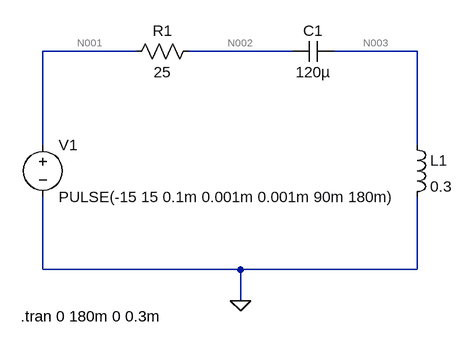
[diagram p0: schematic schemeRLC.asc]
schemeRLC.asc, the LTspice schematic file:
Version 4
SHEET 1 880 680
WIRE 96 96 -48 96
WIRE 336 96 176 96
WIRE 528 96 400 96
WIRE -48 240 -48 96
WIRE 528 240 528 96
WIRE -48 432 -48 320
WIRE 256 432 -48 432
WIRE 528 432 528 320
WIRE 528 432 256 432
WIRE 256 480 256 432
FLAG 256 480 0
SYMBOL res 192 80 R90
WINDOW 0 0 56 VBottom 2
WINDOW 3 32 56 VTop 2
SYMATTR InstName R1
SYMATTR Value 25
SYMBOL cap 400 80 R90
WINDOW 0 0 32 VBottom 2
WINDOW 3 32 32 VTop 2
SYMATTR InstName C1
SYMATTR Value 120µ
SYMBOL ind 512 224 R0
SYMATTR InstName L1
SYMATTR Value 0.3
SYMBOL voltage -48 224 R0
WINDOW 123 0 0 Left 0
WINDOW 39 0 0 Left 0
SYMATTR InstName V1
SYMATTR Value PULSE(-15 15 0.1m 0.001m 0.001m 90m 180m)
TEXT -82 504 Left 2 !.tran 0 180m 0 0.3m

The netlist it stands for:
* schemeRLC.asc
R1 N002 N001 25
C1 N003 N002 120µ
L1 N003 0 0.3
V1 N001 0 PULSE(-15 15 0.1m 0.001m 0.001m 90m 180m)
.tran 0 180m 0 0.3m
.backanno
.end

* Results of the author's LTspice run, read from the files saved beside the schematic
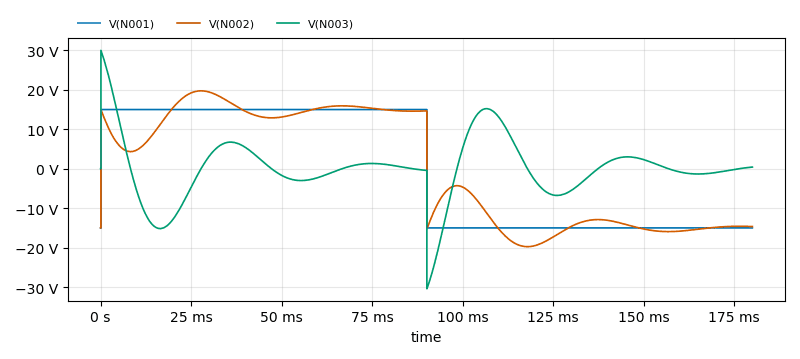
[diagram p1: Transient Analysis of schemeRLC.asc, plotted from the saved traces]
* Transient Analysis, 1 run:
*   V(N001): min -15 V, max 15 V, average 166.7 µV, rms 15 V, last -15 V
*   V(N002): min -19.76 V, max 19.74 V, average 1.443 mV, rms 14.49 V, last -14.65 V
*   V(N003): min -30.43 V, max 30 V, average -23.47 mV, rms 7.799 V, last 417.1 mV